# Altium schematic sheet Integrate.SchDoc
size A
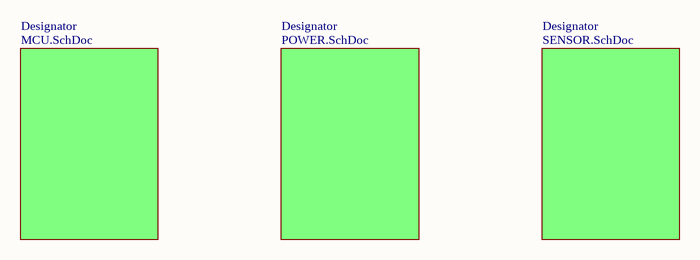
[diagram p0: Integrate.SchDoc]

## Sub-sheets
Designator = MCU.SchDoc: no entries
Designator = POWER.SchDoc: no entries
Designator = SENSOR.SchDoc: no entries